# Altium schematic sheet 03.Block Diagram.SchDoc
size 594 x 420 mm; Revision: V2.1; Schematic Page Number: 11; Page Number: 4; Check: Default; Schematic Name: RK_NVR_DEMO1_RK3588_LP4/4x_V21; Page Count: 43; Page name: 03.Block Diagram; Designer: Zhangdz; Schematic Page Count: 99; Revcode: V2.1; DsnPath: E:\Work\SBER\RK3588_SOM\temp\RK_NVR_DEMO1_RK3588_LP4XD200P232SD8_V21_20211228.DSN; SchematicName: RK_NVR_DEMO1_RK3588_LP4/4x_V21; PageName: 03.Block Diagram; PageSize: A2; TopSchematic: True
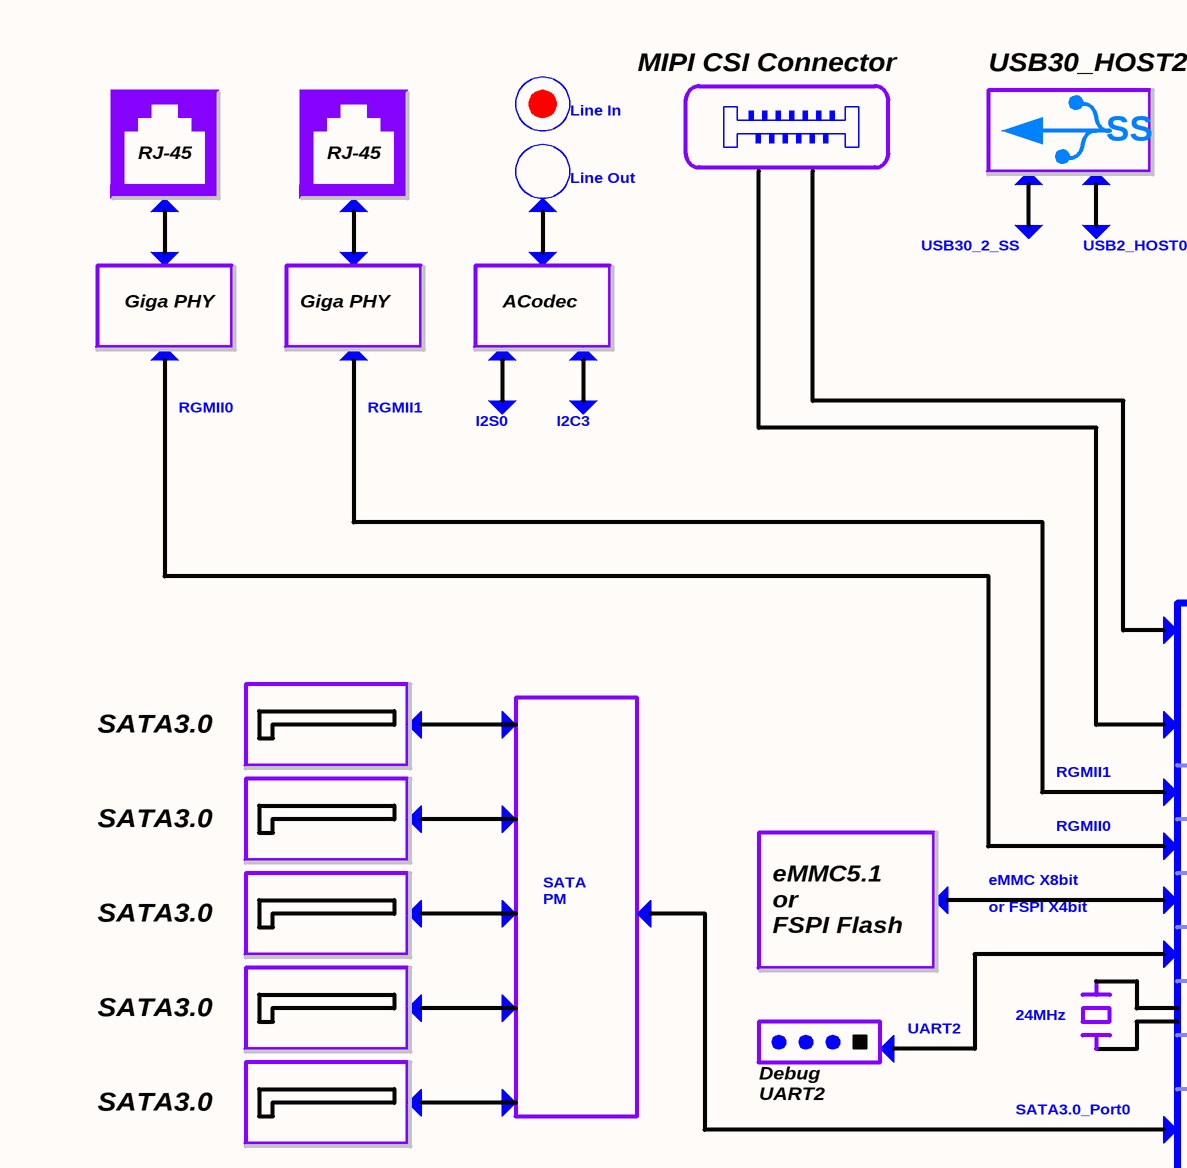
[diagram p0: 03.Block Diagram.SchDoc, top left]
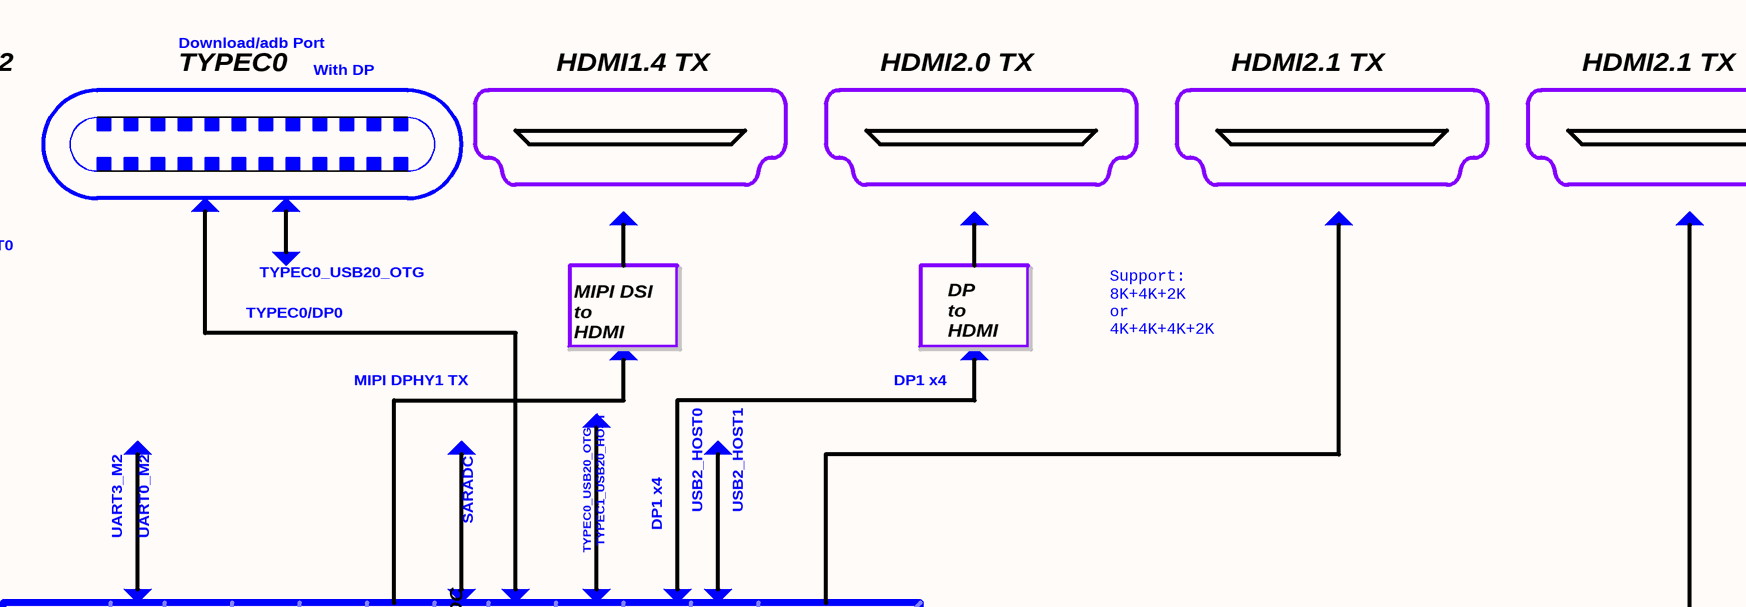
[diagram p1: 03.Block Diagram.SchDoc, top right]
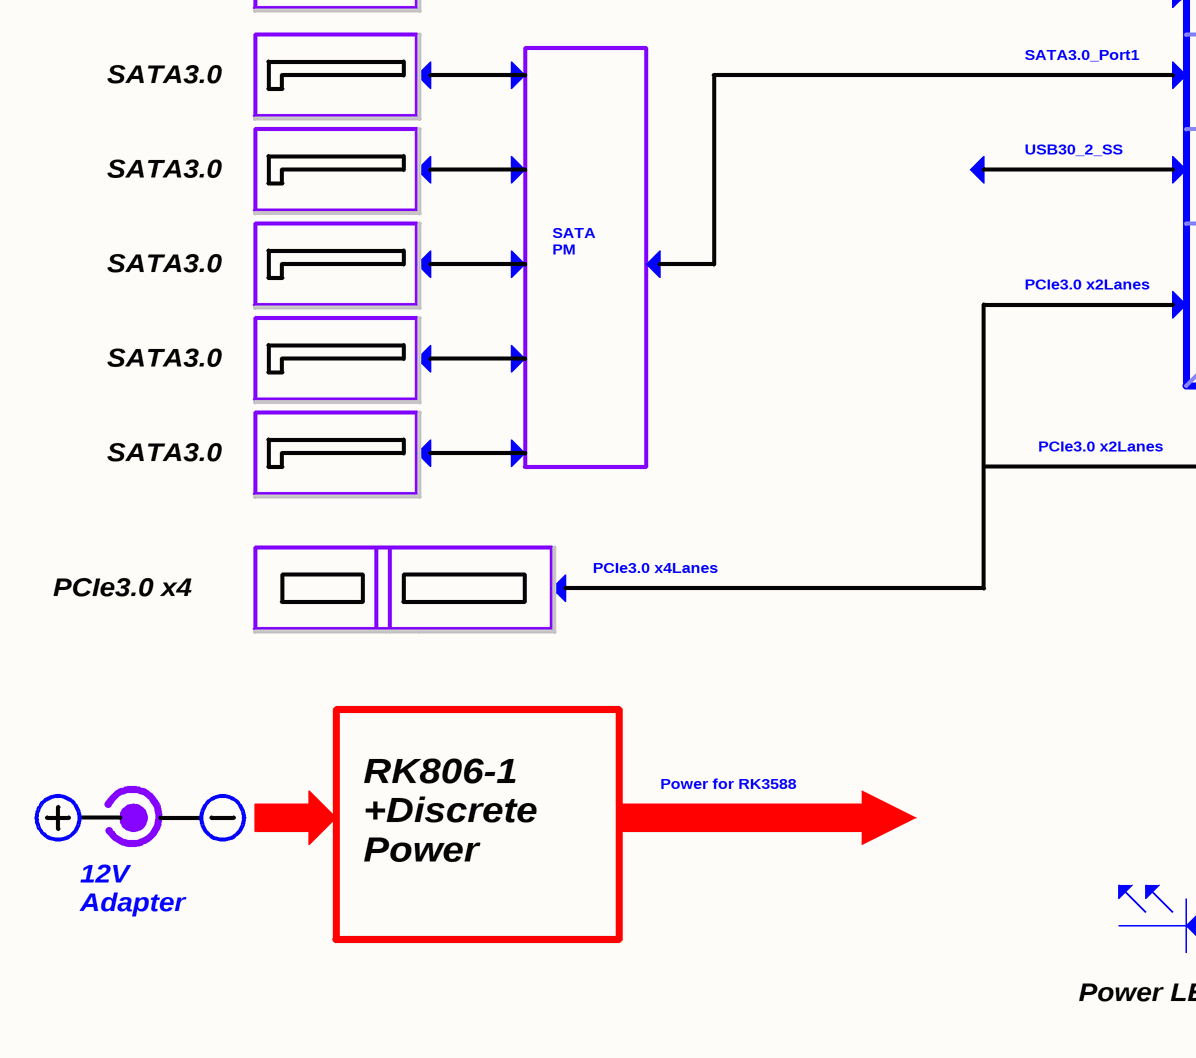
[diagram p2: 03.Block Diagram.SchDoc, bottom left]
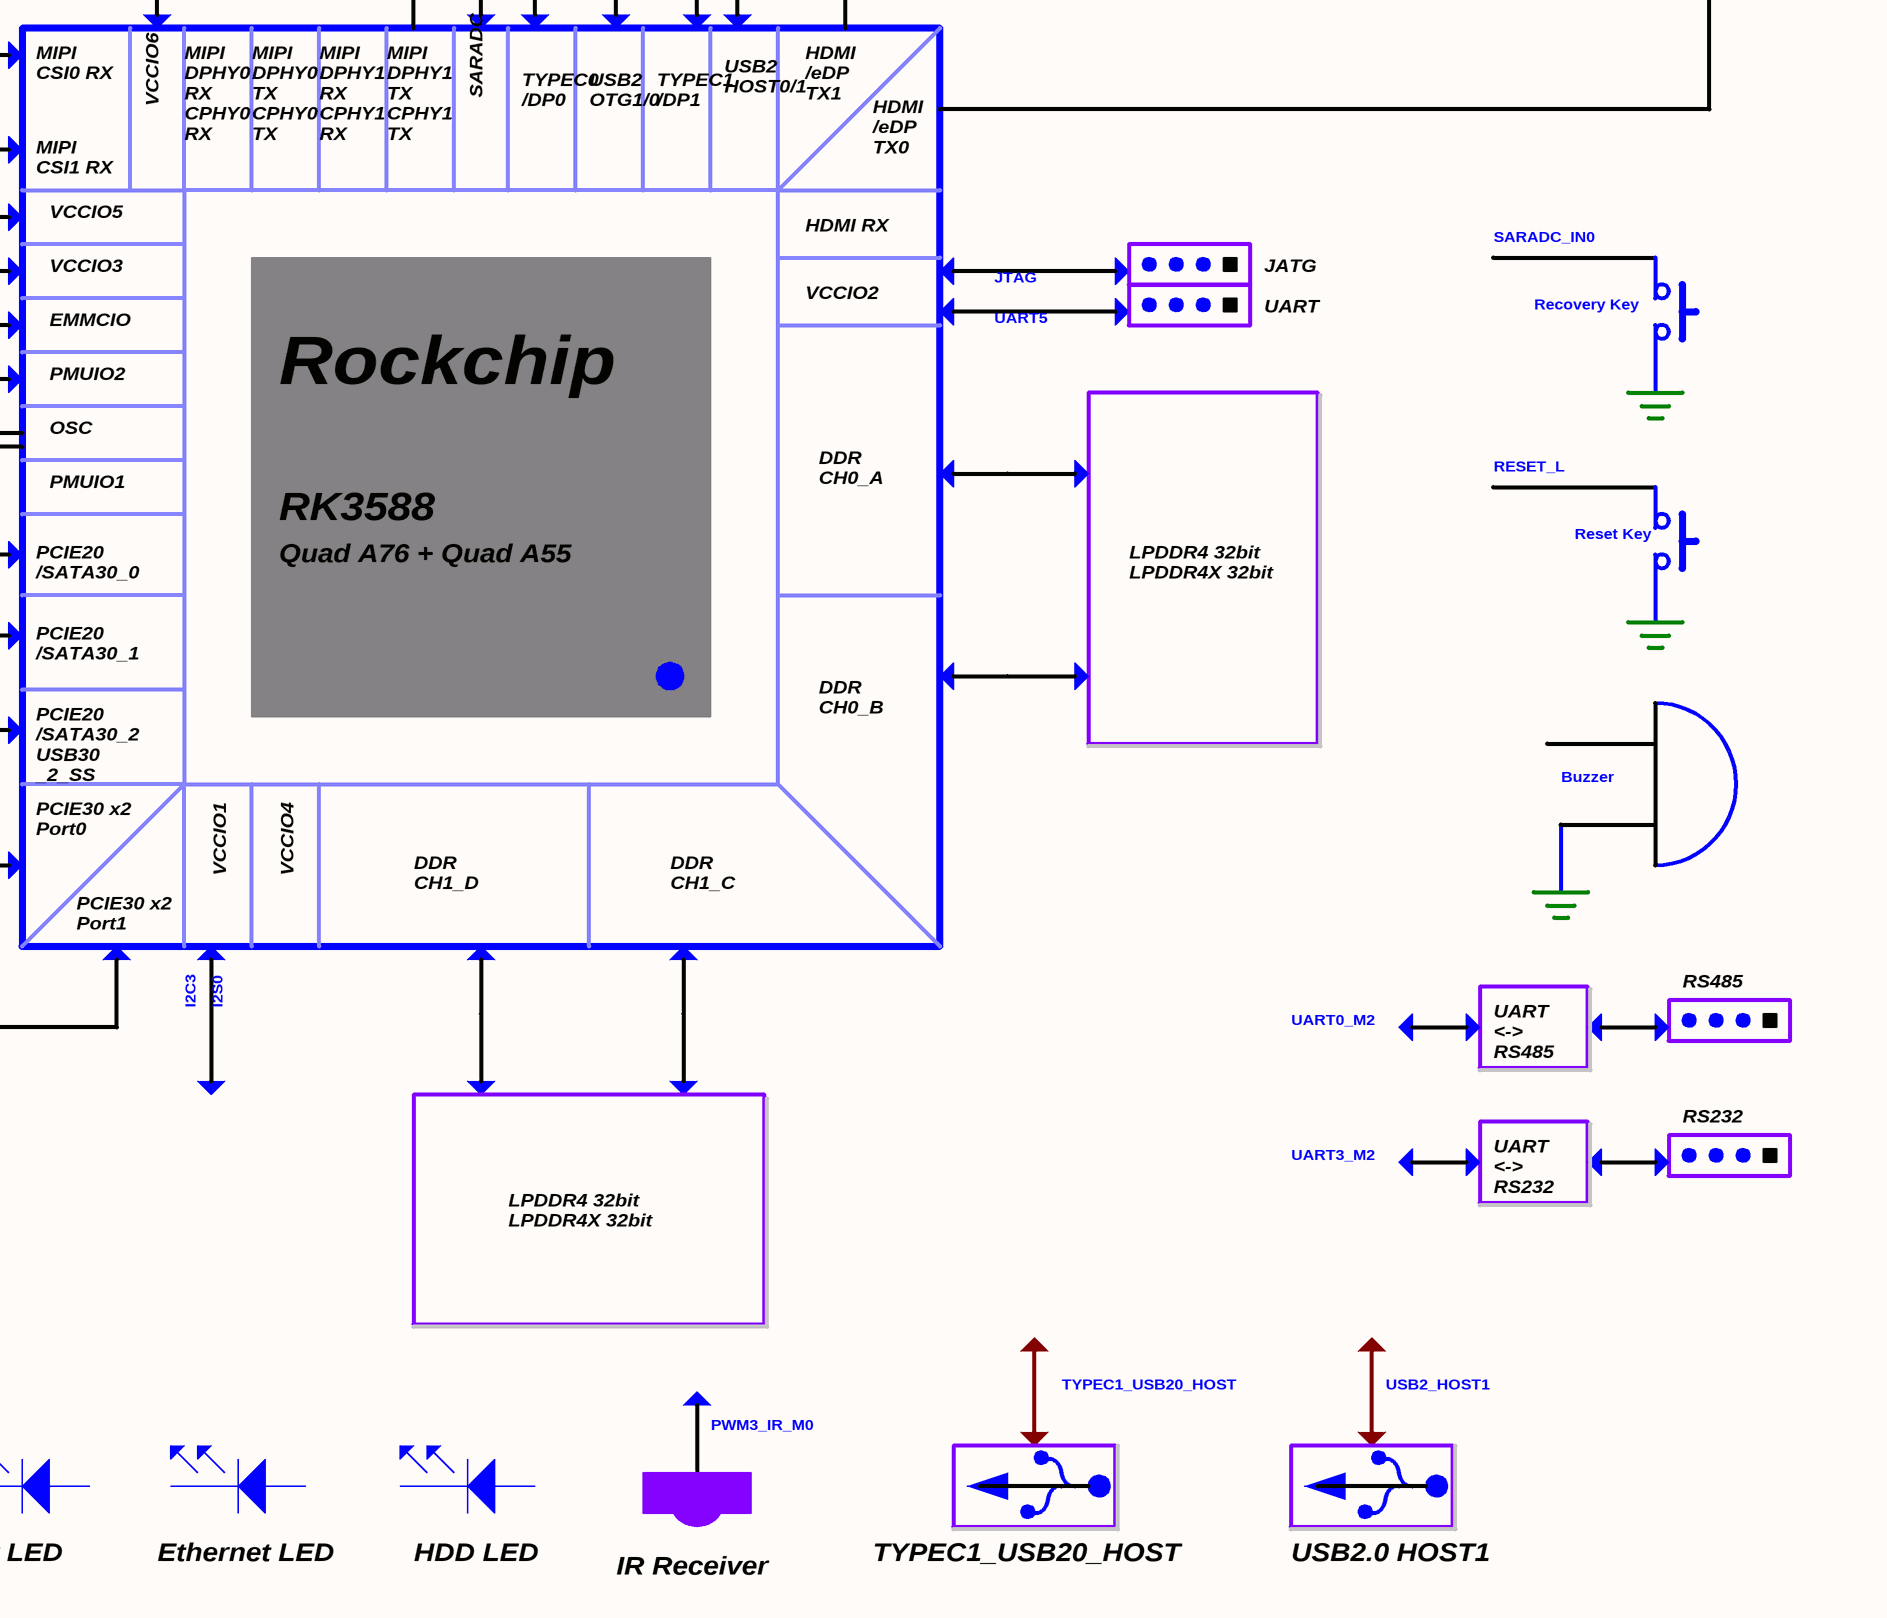
[diagram p3: 03.Block Diagram.SchDoc, bottom right]

## Notes on the sheet
- MIPI CSI Connector
- USB30_HOST2
- TYPEC0
- Download/adb Port
- With DP
- HDMI1.4 TX
- HDMI2.0 TX
- HDMI2.1 TX
- Line In
- SS
- RJ-45
- Line Out
- USB30_2_SS
- USB2_HOST0
- TYPEC0_USB20_OTG
- Giga PHY
- ACodec
- TYPEC0/DP0
- MIPI DSI
  to
  HDMI
- DP
  to
  HDMI
- Support:
  8K+4K+2K
  or
  4K+4K+4K+2K
- RGMII0
- RGMII1
- MIPI DPHY1 TX
- DP1 x4
- I2S0
- I2C3
- UART3_M2
- UART0_M2
- SARADC
- TYPEC1_USB20_HOST
- USB2_HOST1
- MIPI
  CSI0 RX
- VCCIO6
- HDMI
  /eDP
  TX1
- SATA3.0
- MIPI
  CSI1 RX
- MIPI
  DPHY0 RX
  CPHY0 RX
- MIPI
  DPHY0 TX
  CPHY0 TX
- MIPI
  DPHY1 RX
  CPHY1 RX
- MIPI
  DPHY1 TX
  CPHY1 TX
- TYPEC0
  /DP0
- USB2
  OTG1/0
- TYPEC1
  /DP1
- USB2
  HOST0/1
- HDMI
  /eDP
  TX0
- VCCIO5
- HDMI RX
- SARADC_IN0
- eMMC X8bit
- VCCIO3
- VCCIO2
- JTAG
- UART
- JATG
- Recovery Key
- SATA
  PM
- eMMC5.1
  or
  FSPI Flash
- or FSPI X4bit
- EMMCIO
- UART5
- 24MHz
- PMUIO2
- OSC
- Rockchip
- UART2
- PMUIO1
- DDR
  CH0_A
- RESET_L
- Debug
  UART2
- SATA3.0_Port0
- PCIE20
  /SATA30_0
- RK3588
- Quad A76 + Quad A55
- LPDDR4 32bit
  LPDDR4X 32bit
- Reset Key
- SATA3.0_Port1
- PCIE20
  /SATA30_1
- DDR
  CH0_B
- PCIE20
  /SATA30_2
  USB30
  _2_SS
- Buzzer
- PCIe3.0 x2Lanes
- PCIE30 x2
  Port0
- VCCIO1
- VCCIO4
- DDR
  CH1_D
- DDR
  CH1_C
- PCIE30 x2
  Port1
- RS485
- UART
  <->
  RS485
- RS232
- PCIe3.0 x4
- PCIe3.0 x4Lanes
- UART
  <->
  RS232
- Power for RK3588
- RK806-1
  +Discrete
  Power
- PWM3_IR_M0
- 12V
  Adapter
- Power LED
- Ethernet LED
- HDD LED
- IR Receiver
- USB2.0 HOST1